# EAGLE schematic Fall2018AvionicsBay (EAGLE 8.5.2)
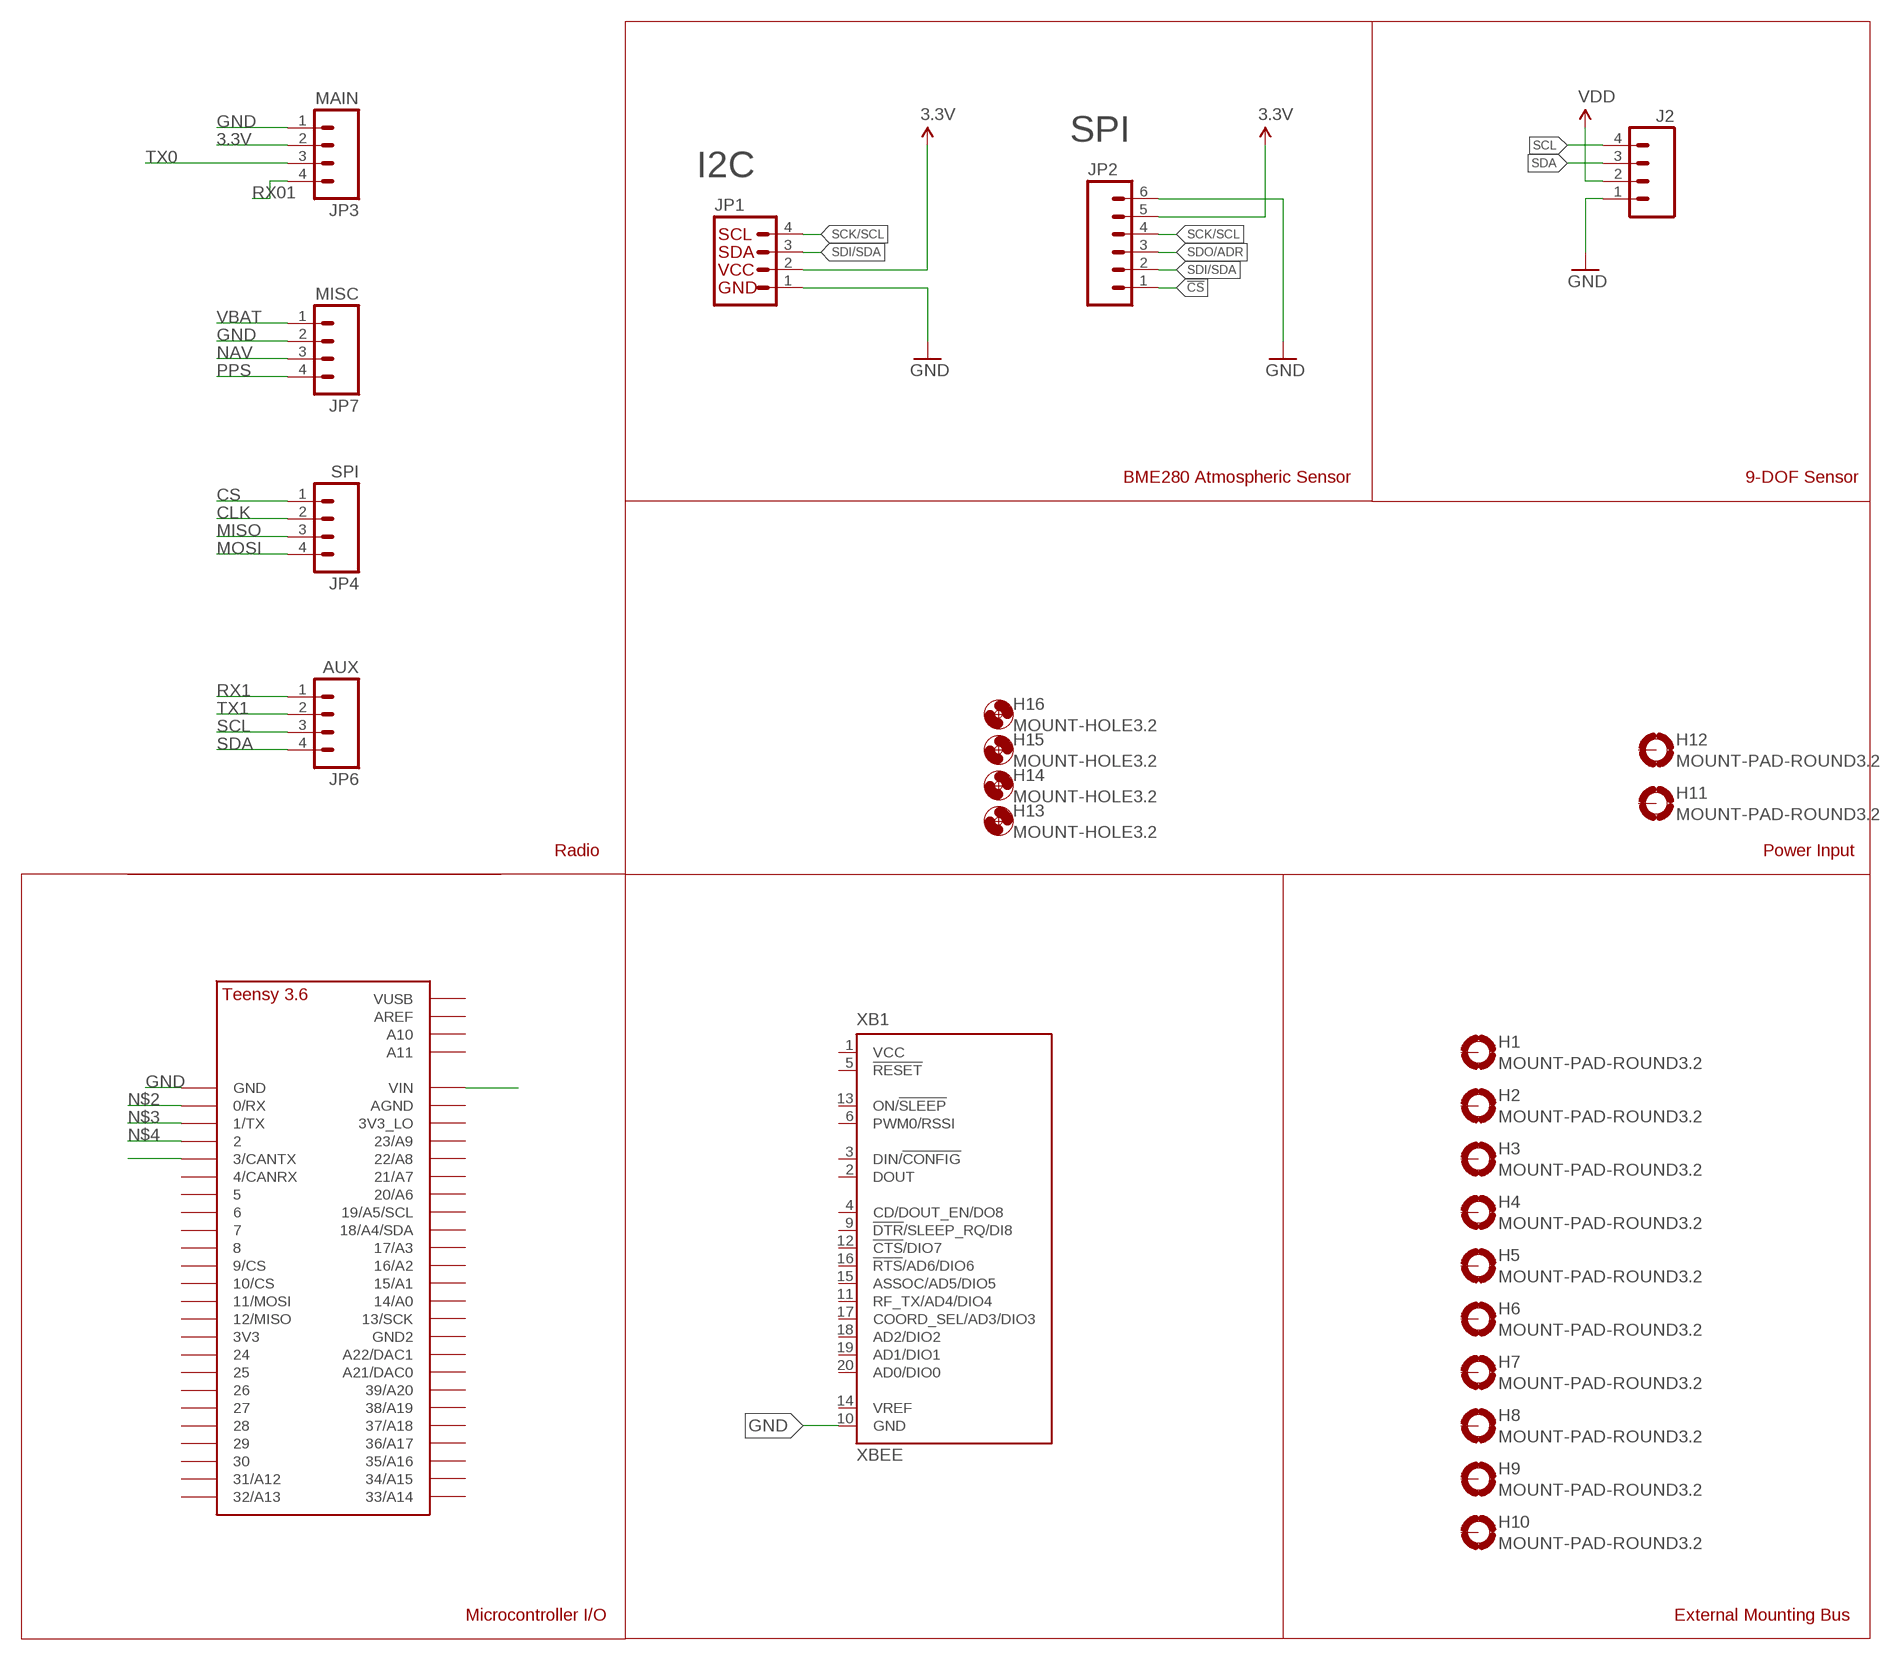
[diagram p0: schematic, sheet 1]

## Parts
H1  MOUNT-PAD-ROUND3.2  [3,2-PAD]
H2  MOUNT-PAD-ROUND3.2  [3,2-PAD]
H3  MOUNT-PAD-ROUND3.2  [3,2-PAD]
H4  MOUNT-PAD-ROUND3.2  [3,2-PAD]
H5  MOUNT-PAD-ROUND3.2  [3,2-PAD]
H6  MOUNT-PAD-ROUND3.2  [3,2-PAD]
H7  MOUNT-PAD-ROUND3.2  [3,2-PAD]
H8  MOUNT-PAD-ROUND3.2  [3,2-PAD]
H9  MOUNT-PAD-ROUND3.2  [3,2-PAD]
H10  MOUNT-PAD-ROUND3.2  [3,2-PAD]
H11  MOUNT-PAD-ROUND3.2  [3,2-PAD]
H12  MOUNT-PAD-ROUND3.2  [3,2-PAD]
H13  MOUNT-HOLE3.2  [3,2]
H14  MOUNT-HOLE3.2  [3,2]
H15  MOUNT-HOLE3.2  [3,2]
H16  MOUNT-HOLE3.2  [3,2]
J2  M04NO_SILK_ALL_ROUND  [1X04_NO_SILK_ALL_ROUND]
JP1  I2C_STANDARD_NO_SILK  [1X04_NO_SILK]
JP2  M06NO_SILK_FEMALE_PTH  [1X06_NO_SILK]
JP3  MAIN  M04PTH  [1X04]
JP4  SPI  M04PTH  [1X04]
JP6  AUX  M04PTH  [1X04]
JP7  MISC  M04PTH  [1X04]
U$1  TEENSY_3.5/3.6_BASIC  [TEENSY_3.5/3.6_BASIC]
XB1  XBEE  [XBEE]

## Nets
3.3V: JP1.2 JP2.5 JP3.2
!CS: JP2.1
CLK: JP4.2
CS: JP4.1
GND: J2.1 JP1.1 JP2.6 JP3.1 JP7.2 U$1.GND XB1.10(GND)
MISO: JP4.3
MOSI: JP4.4
N$2: U$1.0/RX
N$3: U$1.1/TX
N$4: U$1.2
N$5: U$1.3/CANTX
N$6: U$1.VIN
NAV: JP7.3
PPS: JP7.4
RX1: JP6.1
RX01: JP3.4
SCK/SCL: JP1.4 JP2.4
SCL: J2.4 JP6.3
SDA: J2.3 JP6.4
SDI/SDA: JP1.3 JP2.2
SDO/ADR: JP2.3
TX0: JP3.3
TX1: JP6.2
VBAT: JP7.1
VDD: J2.2
Unconnected: H1.B3,2(MOUNT) H2.B3,2(MOUNT) H3.B3,2(MOUNT) H4.B3,2(MOUNT) H5.B3,2(MOUNT) H6.B3,2(MOUNT) H7.B3,2(MOUNT) H8.B3,2(MOUNT) H9.B3,2(MOUNT) H10.B3,2(MOUNT) H11.B3,2(MOUNT) H12.B3,2(MOUNT) U$1.3V3 U$1.3V3_LO U$1.4/CANRX U$1.5 U$1.6 U$1.7 U$1.8 U$1.9/CS U$1.10/CS U$1.11/MOSI U$1.12/MISO U$1.13/SCK U$1.14/A0 U$1.15/A1 U$1.16/A2 U$1.17/A3 U$1.18/A4/SDA U$1.19/A5/SCL U$1.20/A6 U$1.21/A7 U$1.21/DAC0(A21/DAC0) U$1.22/A8 U$1.23/A9 U$1.24 U$1.25 U$1.26 U$1.27 U$1.28 U$1.29 U$1.30 U$1.31/A12 U$1.32/A13 U$1.33/A14 U$1.34/A15 U$1.35/A16 U$1.36/A17 U$1.37/A18 U$1.38/A19 U$1.39/A20 U$1.A10 U$1.A11 U$1.A22/DAC1 U$1.AGND U$1.AREF U$1.GND2 U$1.VUSB XB1.2(DOUT) XB1.3(DIN/!CONFIG) XB1.4(CD/DOUT_EN/DO8) XB1.5(!RESET) XB1.6(PWM0/RSSI) XB1.9(!DTR!/SLEEP_RQ/DI8) XB1.11(RF_TX/AD4/DIO4) XB1.12(!CTS!/DIO7) XB1.13(ON/!SLEEP) XB1.14(VREF) XB1.15(ASSOC/AD5/DIO5) XB1.16(!RTS!/AD6/DIO6) XB1.17(COORD_SEL/AD3/DIO3) XB1.18(AD2/DIO2) XB1.19(AD1/DIO1) XB1.20(AD0/DIO0)

## Notes on the sheet
- SPI
- I2C
- BME280 Atmospheric Sensor | 9-DOF Sensor
- Radio | Power Input
- Microcontroller I/O | External Mounting Bus

## Power pins joined to a net without a drawn wire
VCC: XB1.1(VCC)

## Library data of the parts
H1-H12 = holes:MOUNT-PAD-ROUND: MOUNTING PAD, round
H13-H16 = holes:MOUNT-HOLE: MOUNTING HOLE with drill center marker
J2 = SparkFun-Connectors:M04: Header 4 Standard 4-pin 0.1" header. Use with straight break away headers (SKU : PRT-00116), right angle break away headers (PRT-00553), swiss pins (PRT-00743), machine pins (PRT-00117), and female headers (PRT-00115). Molex polarized connector foot print use with SKU : PRT-08231 with associated crimp pins and housings. 1MM SMD Version SKU: PRT-10208; PROD_ID: CONN-09696
JP1 = SparkFun-Connectors:I2C_STANDARD: SparkFun has standardized on a pinout for all I2C based sensor breakouts. This pinout allows I2C boards to be plugged directly into the headers on Arduino Uno compatible boards, and to be daisy chained easily.
JP2 = SparkFun-Connectors:M06: Header 6 Standard 6-pin 0.1" header. Use with straight break away headers (SKU : PRT-00116), right angle break away headers (PRT-00553), swiss pins (PRT-00743), machine pins (PRT-00117), and female headers (PRT-00115). Molex polarized connector foot print use with SKU : PRT-08094 with associated crimp pins and housings. NOTES ON THE VARIANTS LOCK and LOCK_LONGPADS... This footprint was designed to help hold the alignment of a through-hole component (i.e. 6-pin header) while soldering it into place. You may notice that each hole has been shifted either up or down by 0.005 of an inch from it's more standard position (which is a perfectly straight line). This slight alteration caused the pins (the squares in the middle) to touch the edges of the holes. Because they are alternating, it causes a "brace" to hold the component in place. 0.005 has proven to be the perfect amount of "off-center" position when using our standard breakaway headers. Although looks a little odd when you look at the bare footprint, once you have a header in there, the alteration is very hard to notice. Also,if you push a header all the way into place, it is covered up entirely on the bottom side. This idea of altering the position of holes to aid alignment will be further integrated into the Sparkfun Library for other footprints. It can help hold any component with 3 or more connection pins.; PROD_ID: CONN-08437
JP3 JP4 JP6 JP7 = SparkFun:M04: Header 4 Standard 4-pin 0.1" header. Use with straight break away headers (SKU : PRT-00116), right angle break away headers (PRT-00553), swiss pins (PRT-00743), machine pins (PRT-00117), and female headers (PRT-00115). Molex polarized connector foot print use with SKU : PRT-08231 with associated crimp pins and housings. 1MM SMD Version SKU: PRT-10208
U$1 = Teensy356:TEENSY_3.5/3.6_BASIC
XB1 = maxstream:XBEE: XBee (TM) /XBee-PRO(TM) OEM RF Modules Source: MaxStream, Inc. xbee_productmanual.pdf; MPN: XBP24-Z7UIT-004; OC_FARNELL: 1751799; OC_NEWARK: 34R5507

## Net classes
1 vcc: width 0.305 mm